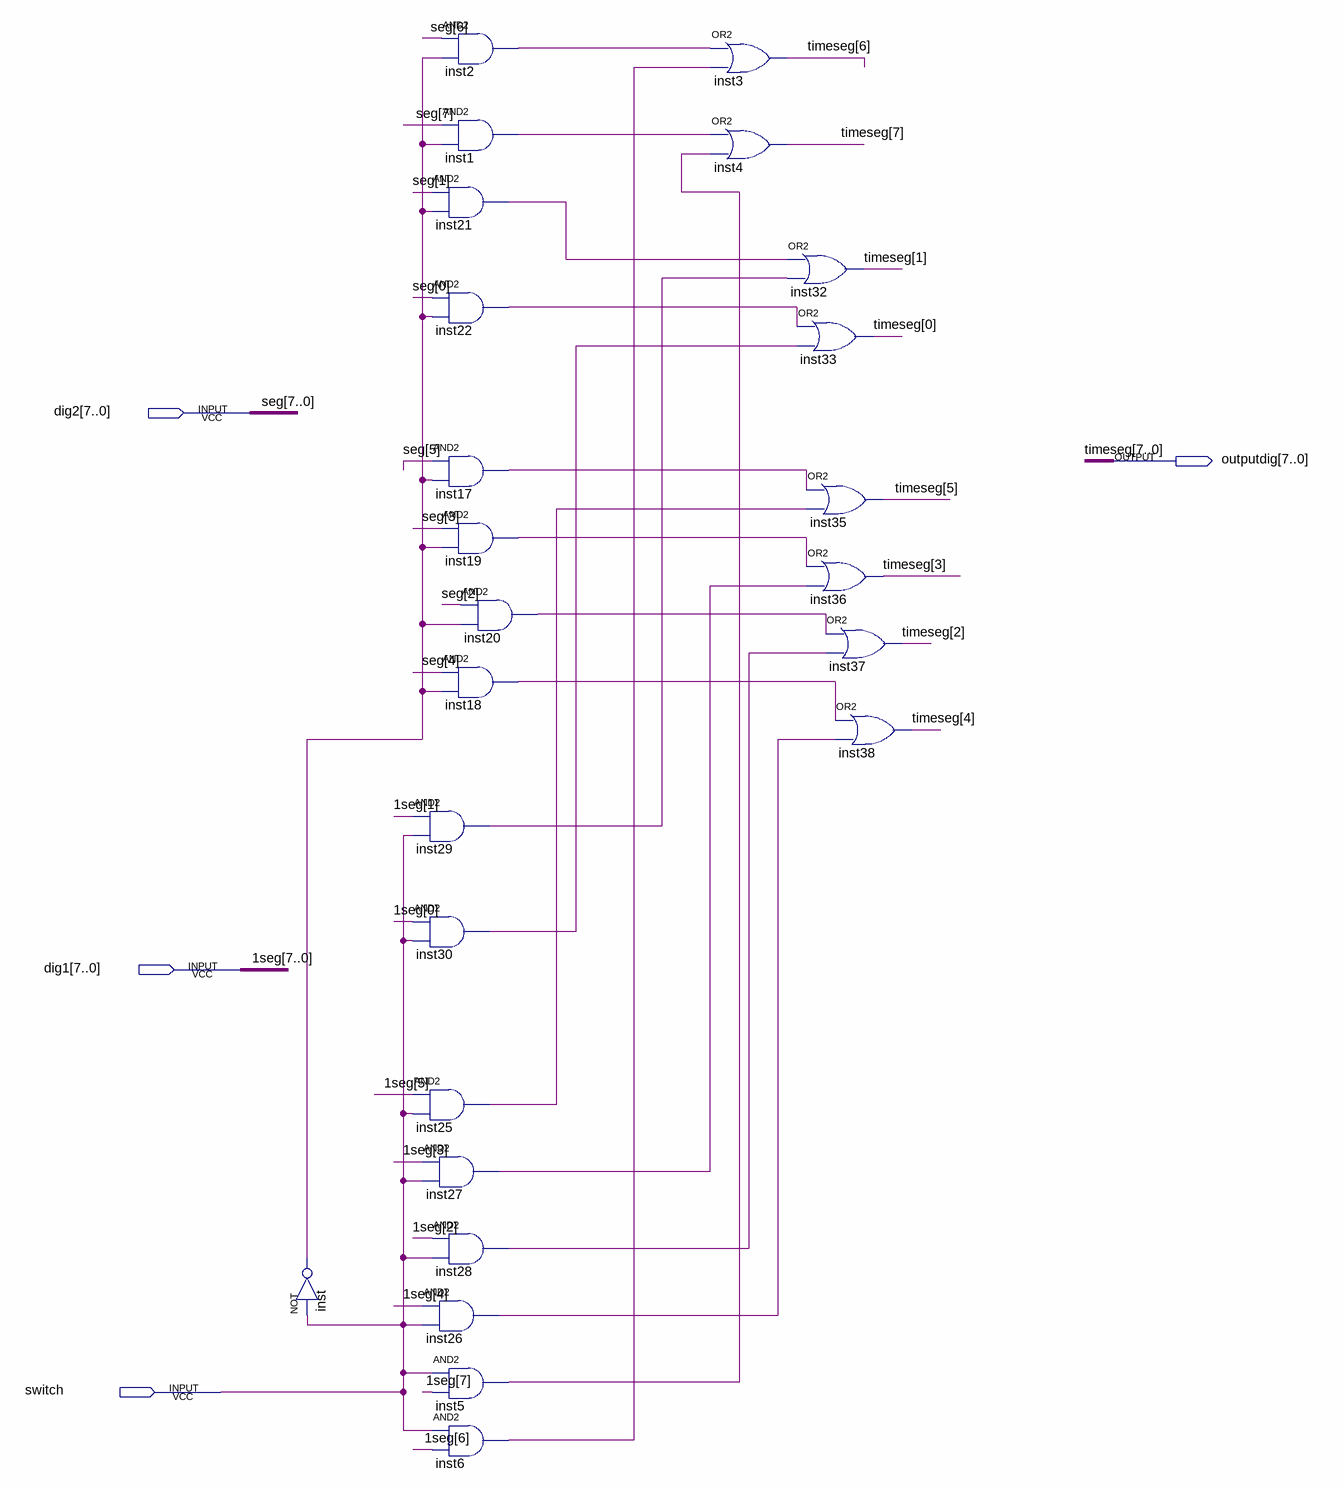
[diagram p0: schematic sheet]
// Quartus schematic choose.bdf as structural Verilog: 25 symbols, 4 pins
module choose (
  input  [7:0] dig2,
  input  [7:0] dig1,
  input  switch,
  output [7:0] outputdig
);

  wire inst1_out, inst2_out, inst5_out, inst6_out, inst17_out, inst18_out, inst19_out, inst20_out,
       inst21_out, inst22_out, inst25_out, inst26_out, inst27_out, inst28_out, inst29_out, inst30_out,
       inst_out;

  not inst (inst_out, switch);
  and inst2 (inst2_out, dig2[6], inst_out);
  and inst1 (inst1_out, dig2[7], inst_out);
  and inst21 (inst21_out, dig2[1], inst_out);
  and inst22 (inst22_out, dig2[0], inst_out);
  and inst17 (inst17_out, dig2[5], inst_out);
  and inst19 (inst19_out, dig2[3], inst_out);
  and inst18 (inst18_out, dig2[4], inst_out);
  and inst29 (inst29_out, dig1[1], switch);
  and inst30 (inst30_out, dig1[0], switch);
  and inst25 (inst25_out, dig1[5], switch);
  and inst27 (inst27_out, dig1[3], switch);
  and inst28 (inst28_out, dig1[2], switch);
  and inst26 (inst26_out, dig1[4], switch);
  and inst5 (inst5_out, switch, dig1[7]);
  and inst6 (inst6_out, switch, dig1[6]);
  and inst20 (inst20_out, dig2[2], inst_out);
  or inst3 (outputdig[6], inst2_out, inst6_out);
  or inst4 (outputdig[7], inst1_out, inst5_out);
  or inst32 (outputdig[1], inst21_out, inst29_out);
  or inst33 (outputdig[0], inst22_out, inst30_out);
  or inst35 (outputdig[5], inst17_out, inst25_out);
  or inst36 (outputdig[3], inst19_out, inst27_out);
  or inst37 (outputdig[2], inst20_out, inst28_out);
  or inst38 (outputdig[4], inst18_out, inst26_out);

  // Other names for the same wires on the sheet: 1seg[7:0] = dig1; seg[7:0] = dig2; timeseg[7:0] = outputdig
endmodule
